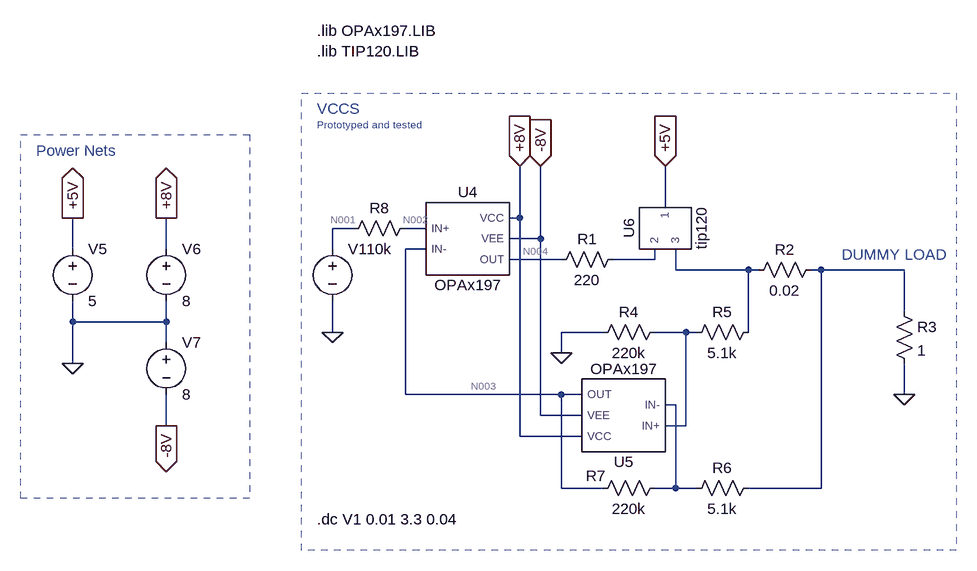
[diagram p0: schematic VCCS.asc]
VCCS.asc, the LTspice schematic file:
Version 4
SHEET 1 1476 776
WIRE 656 240 656 176
WIRE 432 256 432 176
WIRE 432 256 416 256
WIRE 176 272 144 272
WIRE 288 272 256 272
WIRE 464 288 464 176
WIRE 464 288 416 288
WIRE -256 304 -256 256
WIRE -112 304 -112 256
WIRE 144 304 144 272
WIRE 288 304 256 304
WIRE 496 320 416 320
WIRE 640 320 640 304
WIRE 640 320 576 320
WIRE 672 336 672 304
WIRE 784 336 672 336
WIRE 800 336 784 336
WIRE 896 336 880 336
WIRE 1024 336 896 336
WIRE 1024 400 1024 336
WIRE -256 416 -256 384
WIRE -112 416 -112 384
WIRE -112 416 -256 416
WIRE 144 432 144 384
WIRE 560 432 496 432
WIRE 688 432 640 432
WIRE 704 432 688 432
WIRE 784 432 784 336
WIRE -112 448 -112 416
WIRE 496 464 496 432
WIRE -256 480 -256 416
WIRE 256 528 256 304
WIRE 496 528 256 528
WIRE 528 528 496 528
WIRE 1024 528 1024 480
WIRE 672 544 656 544
WIRE 464 560 464 288
WIRE 528 560 464 560
WIRE -112 576 -112 528
WIRE 688 576 688 432
WIRE 688 576 656 576
WIRE 432 592 432 256
WIRE 528 592 432 592
WIRE 496 672 496 528
WIRE 560 672 496 672
WIRE 672 672 672 544
WIRE 672 672 640 672
WIRE 704 672 672 672
WIRE 896 672 896 336
WIRE 896 672 784 672
FLAG 1024 528 0
FLAG 496 464 0
FLAG 144 432 0
FLAG -256 480 0
FLAG -256 256 +5V
IOPIN -256 256 Out
FLAG 656 176 +5V
IOPIN 656 176 In
FLAG -112 256 +8V
IOPIN -112 256 Out
FLAG -112 576 -8V
IOPIN -112 576 Out
FLAG 432 176 +8V
IOPIN 432 176 In
FLAG 464 176 -8V
IOPIN 464 176 In
SYMBOL res 896 320 R90
WINDOW 0 0 56 VBottom 2
WINDOW 3 32 56 VTop 2
SYMATTR InstName R2
SYMATTR Value 0.02
SYMBOL res 1008 384 R0
SYMATTR InstName R3
SYMATTR Value 1
SYMBOL res 656 416 R90
WINDOW 0 0 56 VBottom 2
WINDOW 3 32 56 VTop 2
SYMATTR InstName R4
SYMATTR Value 220k
SYMBOL res 800 416 R90
WINDOW 0 0 56 VBottom 2
WINDOW 3 32 56 VTop 2
SYMATTR InstName R5
SYMATTR Value 5.1k
SYMBOL res 800 656 R90
WINDOW 0 0 56 VBottom 2
WINDOW 3 32 56 VTop 2
SYMATTR InstName R6
SYMATTR Value 5.1k
SYMBOL res 656 656 R90
WINDOW 0 13 107 VBottom 2
WINDOW 3 32 56 VTop 2
SYMATTR InstName R7
SYMATTR Value 220k
SYMBOL voltage 144 288 R0
WINDOW 123 0 0 Left 0
WINDOW 39 0 0 Left 0
SYMATTR InstName V1
SYMATTR Value ""
SYMBOL voltage -256 288 R0
WINDOW 123 0 0 Left 0
WINDOW 39 0 0 Left 0
SYMATTR InstName V5
SYMATTR Value 5
SYMBOL voltage -112 288 R0
WINDOW 123 0 0 Left 0
WINDOW 39 0 0 Left 0
SYMATTR InstName V6
SYMATTR Value 8
SYMBOL voltage -112 432 R0
WINDOW 123 0 0 Left 0
WINDOW 39 0 0 Left 0
SYMATTR InstName V7
SYMATTR Value 8
SYMBOL res 272 256 R90
WINDOW 0 0 56 VBottom 2
WINDOW 3 32 56 VTop 2
SYMATTR InstName R8
SYMATTR Value 10k
SYMBOL OPAx197 352 288 R0
SYMATTR InstName U4
SYMBOL OPAx197 592 560 R180
SYMATTR InstName U5
SYMBOL tip120 656 272 M90
SYMATTR InstName U6
SYMBOL res 592 304 R90
WINDOW 0 0 56 VBottom 2
WINDOW 3 32 56 VTop 2
SYMATTR InstName R1
SYMATTR Value 220
TEXT 120 -32 Left 2 !.lib OPAx197.LIB\n.lib TIP120.LIB
TEXT 120 720 Left 2 !.dc V1 0.01 3.3 0.04
TEXT 120 88 Left 2 ;VCCS
TEXT -312 152 Left 2 ;Power Nets
TEXT 928 312 Left 2 ;DUMMY LOAD
TEXT 120 112 Left 1 ;Prototyped and tested
RECTANGLE Normal 16 688 -336 128 2
RECTANGLE Normal 1104 768 96 64 2

The netlist it stands for:
* VCCS.asc
R2 N007 N006 0.02
R3 N007 0 1
R4 N008 0 220k
R5 N006 N008 5.1k
R6 N007 N009 5.1k
R7 N009 N003 220k
V1 N001 0
V5 +5V 0 5
V6 +8V 0 8
V7 0 -8V 8
R8 N002 N001 10k
XU4 N002 N003 +8V -8V N004 OPAx197  ; pins IN+ IN- VCC VEE OUT
XU5 N008 N009 +8V -8V N003 OPAx197  ; pins IN+ IN- VCC VEE OUT
XU6 +5V N005 N006 tip120  ; pins 1 2 3
R1 N005 N004 220
.lib OPAx197.LIB
.lib TIP120.LIB
.dc V1 0.01 3.3 0.04
* VCCS
* Power Nets
* DUMMY LOAD
* Prototyped and tested
.lib Z:\Projects\Programmable_Electronic_Load\LTSpice\Spice Libraries\OPAx197.LIB
.lib Z:\Projects\Programmable_Electronic_Load\LTSpice\Spice Libraries\TIP120.LIB
.backanno
.end

* Results of the author's LTspice run, read from the files saved beside the schematic
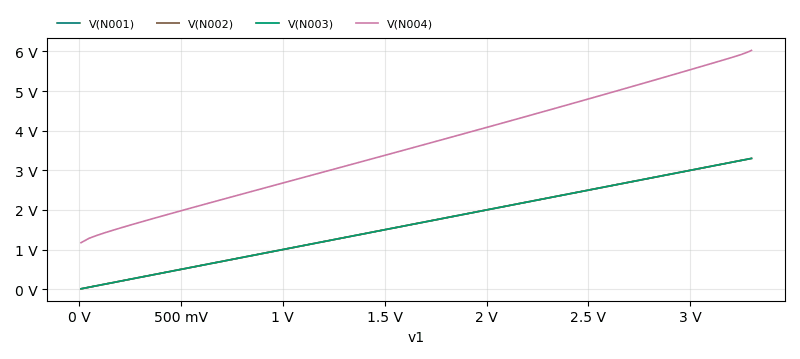
[diagram p1: DC transfer characteristic of VCCS.asc, plotted from the saved traces]
* DC transfer characteristic, 1 run:
*   V(N001): 10 mV at v1=10 mV, 3.3 V at v1=3.3 V, min 10 mV, max 3.3 V
*   V(N002): 10 mV at v1=10 mV, 3.3 V at v1=3.3 V, min 10 mV, max 3.3 V
*   V(N003): 10.02 mV at v1=10 mV, 3.3 V at v1=3.3 V, min 10.02 mV, max 3.3 V
*   V(N004): 1.173 V at v1=10 mV, 6.027 V at v1=3.3 V, min 1.173 V, max 6.027 V